# EAGLE design analog-interface (EAGLE 6.5.0)
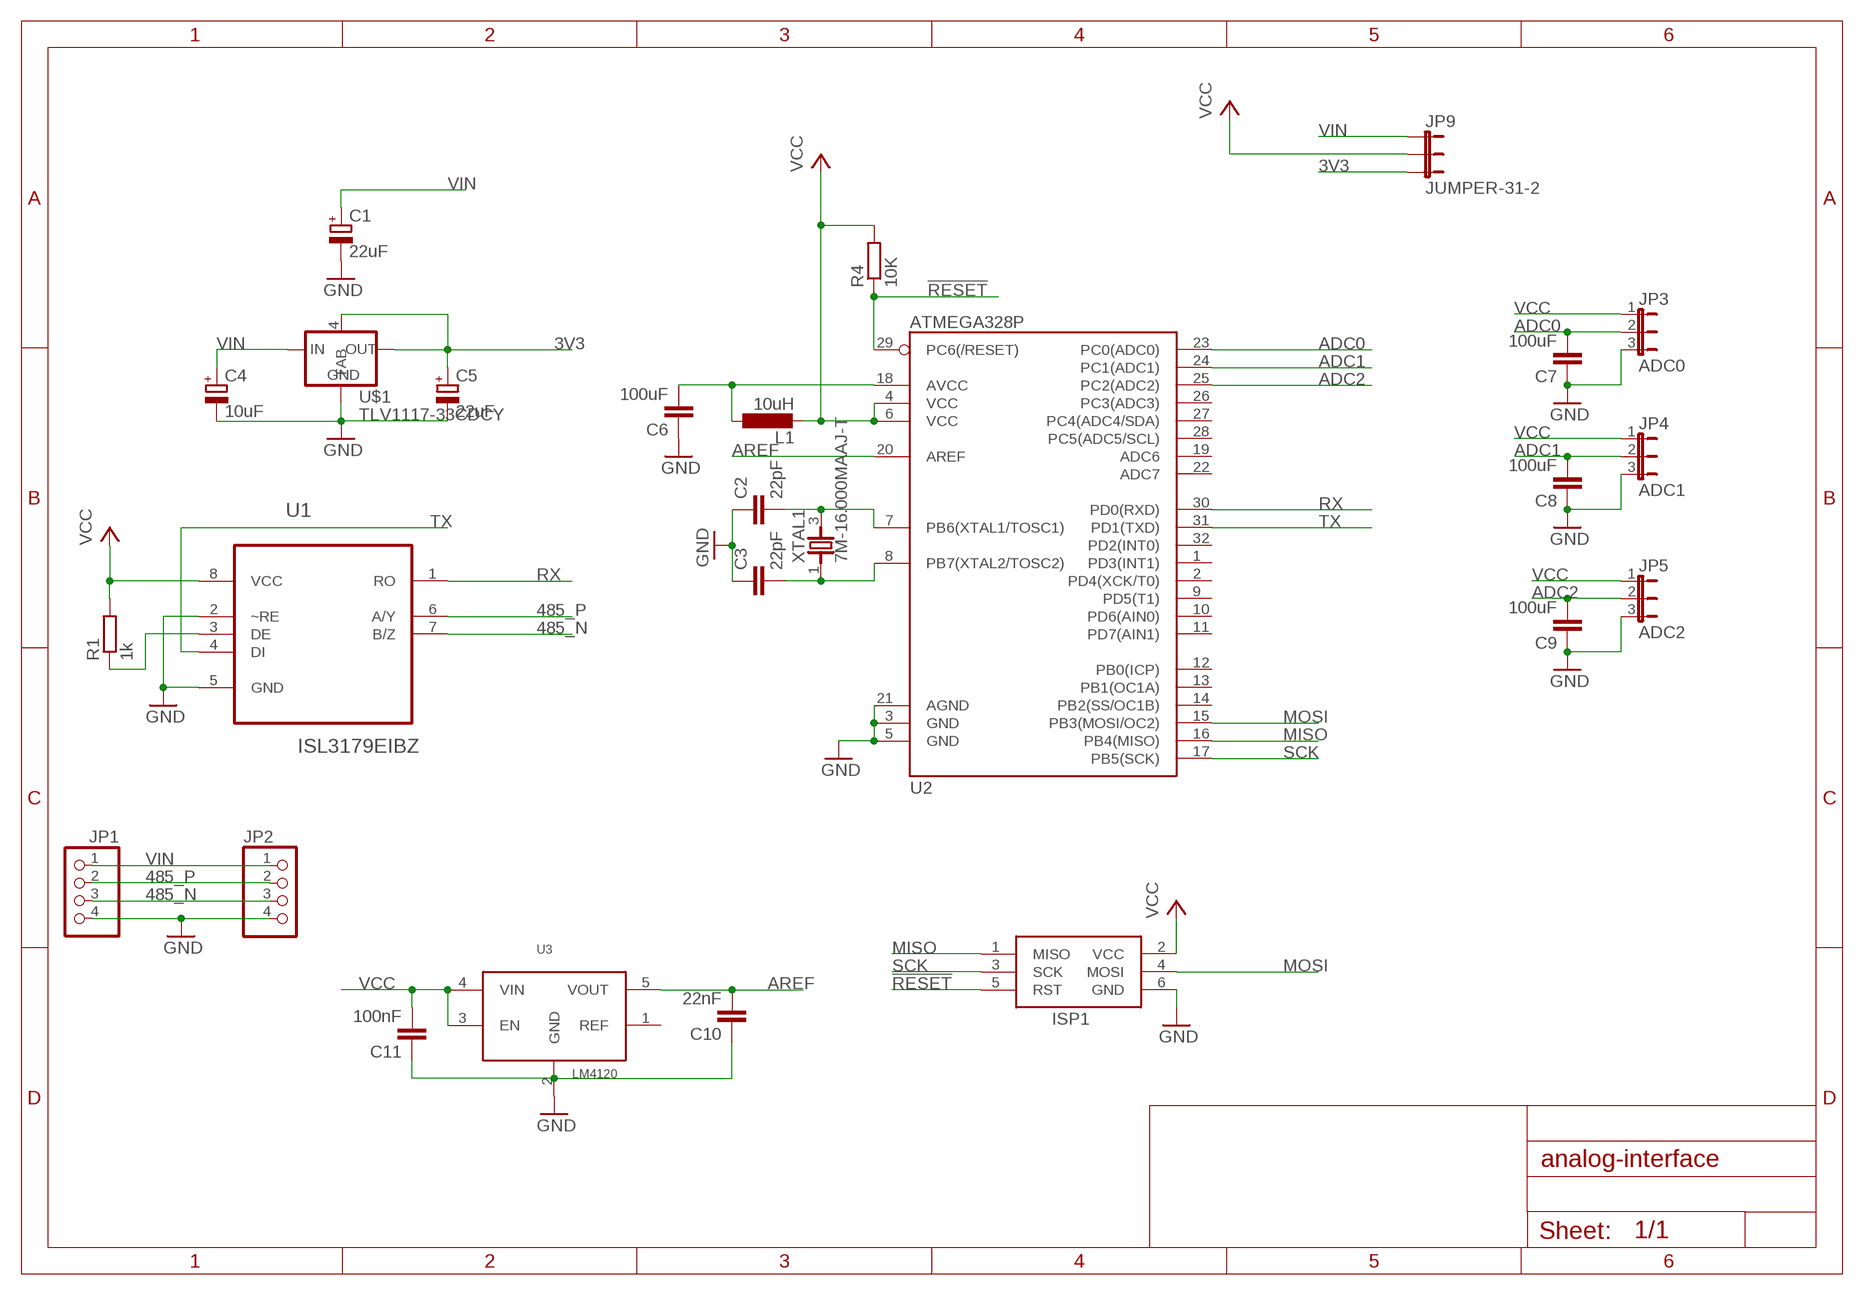
[diagram p0: schematic, sheet 1]

## Parts
C1  22uF  CPOL-EUA/3216-18R  [A/3216-18R]
C2  22pF  C-EUC0805  [C0805]
C3  22pF  C-EUC0805  [C0805]
C4  10uF  CPOL-EUA/3216-18R  [A/3216-18R]
C5  22uF  CPOL-EUA/3216-18R  [A/3216-18R]
C6  100uF  C-EUC0805  [C0805]
C7  100uF  C-EUC0805  [C0805]
C8  100uF  C-EUC0805  [C0805]
C9  100uF  C-EUC0805  [C0805]
C10  22nF  C-EUC0805  [C0805]
C11  100nF  C-EUC0805  [C0805]
ISP1  AVRISP-6  [AVRISP]
JP1  PINHD-1X4  [1X04]
JP2  PINHD-1X4  [1X04]
JP3  ADC0  3-PIN-MOLEX  [3-MOLEX]
JP4  ADC1  3-PIN-MOLEX  [3-MOLEX]
JP5  ADC2  3-PIN-MOLEX  [3-MOLEX]
JP9  JUMPER-31-2  [SJ_3_PASTE1&2]
L1  10uH  L-EUL3216C  [L3216C]
R1  1k  R-EU_R0805  [R0805]
R4  10K  R-EU_R0805  [R0805]
U1  ISL3179EIBZ  [SOIC127P600X175-8N]
U2  ATMEGA328P  ATMEGA328_SMT  [TQFP32-08]
U3  LM4120  [SOT23-5]
U$1  TLV1117-33CDCY  [SOT223]
XTAL1  7M-16.000MAAJ-T  [TXC_7M-16.000MAAJ-T]

## Nets
3V3: C5.+ JP9.3 U$1.2(OUT) U$1.4(TAB)
485_N [rs485]: JP1.3 JP2.3 U1.7(B/Z)
485_P [rs485]: JP1.2 JP2.2 U1.6(A/Y)
!RESET: ISP1.5(RST) R4.1 U2.29(PC6(/RESET))
ADC0: C7.2 JP3.2 U2.23(PC0(ADC0))
ADC1: C8.2 JP4.2 U2.24(PC1(ADC1))
ADC2: C9.2 JP5.2 U2.25(PC2(ADC2))
AREF: C10.2 U2.20(AREF) U3.5(VOUT)
GND: C1.- C2.1 C3.1 C4.- C5.- C6.1 C7.1 C8.1 C9.1 ISP1.6(GND) JP1.4 JP2.4 JP3.3 JP4.3 JP5.3 U1.2(~RE) U1.5(GND) U2.3(GND) U2.5(GND) U2.21(AGND) U3.2(GND) U$1.1(GND)
MISO: ISP1.1(MISO) U2.16(PB4(MISO))
MOSI: ISP1.4(MOSI) U2.15(PB3(MOSI/OC2))
N$1: R1.1 U1.3(DE)
N$2: C2.2 U2.7(PB6(XTAL1/TOSC1)) XTAL1.3
N$3: C3.2 U2.8(PB7(XTAL2/TOSC2)) XTAL1.1
N$4: C6.2 L1.1 U2.18(AVCC)
N$7: C10.1 C11.1
RX: U1.1(RO) U2.30(PD0(RXD))
SCK: ISP1.3(SCK) U2.17(PB5(SCK))
TX: U1.4(DI) U2.31(PD1(TXD))
VCC: C11.2 ISP1.2(VCC) JP3.1 JP4.1 JP5.1 JP9.2 L1.2 R1.2 R4.2 U1.8(VCC) U2.4(VCC) U2.6(VCC) U3.3(EN) U3.4(VIN)
VIN: C1.+ C4.+ JP1.1 JP2.1 JP9.1 U$1.3(IN)
Unconnected: U2.1(PD3(INT1)) U2.2(PD4(XCK/T0)) U2.9(PD5(T1)) U2.10(PD6(AIN0)) U2.11(PD7(AIN1)) U2.12(PB0(ICP)) U2.13(PB1(OC1A)) U2.14(PB2(SS/OC1B)) U2.19(ADC6) U2.22(ADC7) U2.26(PC3(ADC3)) U2.27(PC4(ADC4/SDA)) U2.28(PC5(ADC5/SCL)) U2.32(PD2(INT0)) U3.1(REF)

## Library data of the parts
C1 C4 C5 = resistor:CPOL-EU: POLARIZED CAPACITOR, European symbol
C2 C3 C6-C11 = resistor:C-EU: CAPACITOR, European symbol
ISP1 = adafruit:AVRISP: AVR ISP HEADER Standard 6 pin header for AVR programming
JP1 JP2 = pinhead:PINHD-1X4: PIN HEADER
JP3-JP5 = farnell-parts:3-PIN-MOLEX
JP9 = SparkFun-Passives:JUMPER-3
L1 = resistor:L-EU: INDUCTOR, European symbol
R1 R4 = resistor:R-EU_: RESISTOR, European symbol
U1 = glacsweb:ISL3179EIBZ: TRANCEIVER; MPN: ISL3179EIBZ; OC_FARNELL: 1439860; OC_NEWARK: 58M7513; PACKAGE: SOIC-8; SUPPLIER: Intersil
U2 = SparkFun-DigitalIC:ATMEGA328_SMT: 32-Pin Atmega328 part Commonly used on Arduino compatible boards Available in QFP and QFN packages TQFP is IC-09069 QFN is non-stock; PROD_ID: IC-09069
U3 = mountainsensing:LM4120
U$1 = basestation:TLV1117-33CDCY: Texas Instruments 3.3v 800mA Voltage Regulator http://uk.farnell.com/texas-instruments/tlv1117-33cdcy/v-reg-ldo-3-3v-0-8a-sot-223-4/dp/1494942 Datasheet: http://focus.ti.com/lit/ds/symlink/tlv1117-33.pdf
XTAL1 = TXC-7M-16.000MAAJ-T:7M-16.000MAAJ-T: CRYSTAL SEAM, 16MHZ, 18PF, SMD; MPN: 7M-16.000MAAJ-T; OC_FARNELL: 1842060; OC_NEWARK: 84R5710; PACKAGE: SMD; SUPPLIER: TXC

## Net classes
1 rs485: width 0.305 mm, clearance 0.254 mm

## Board
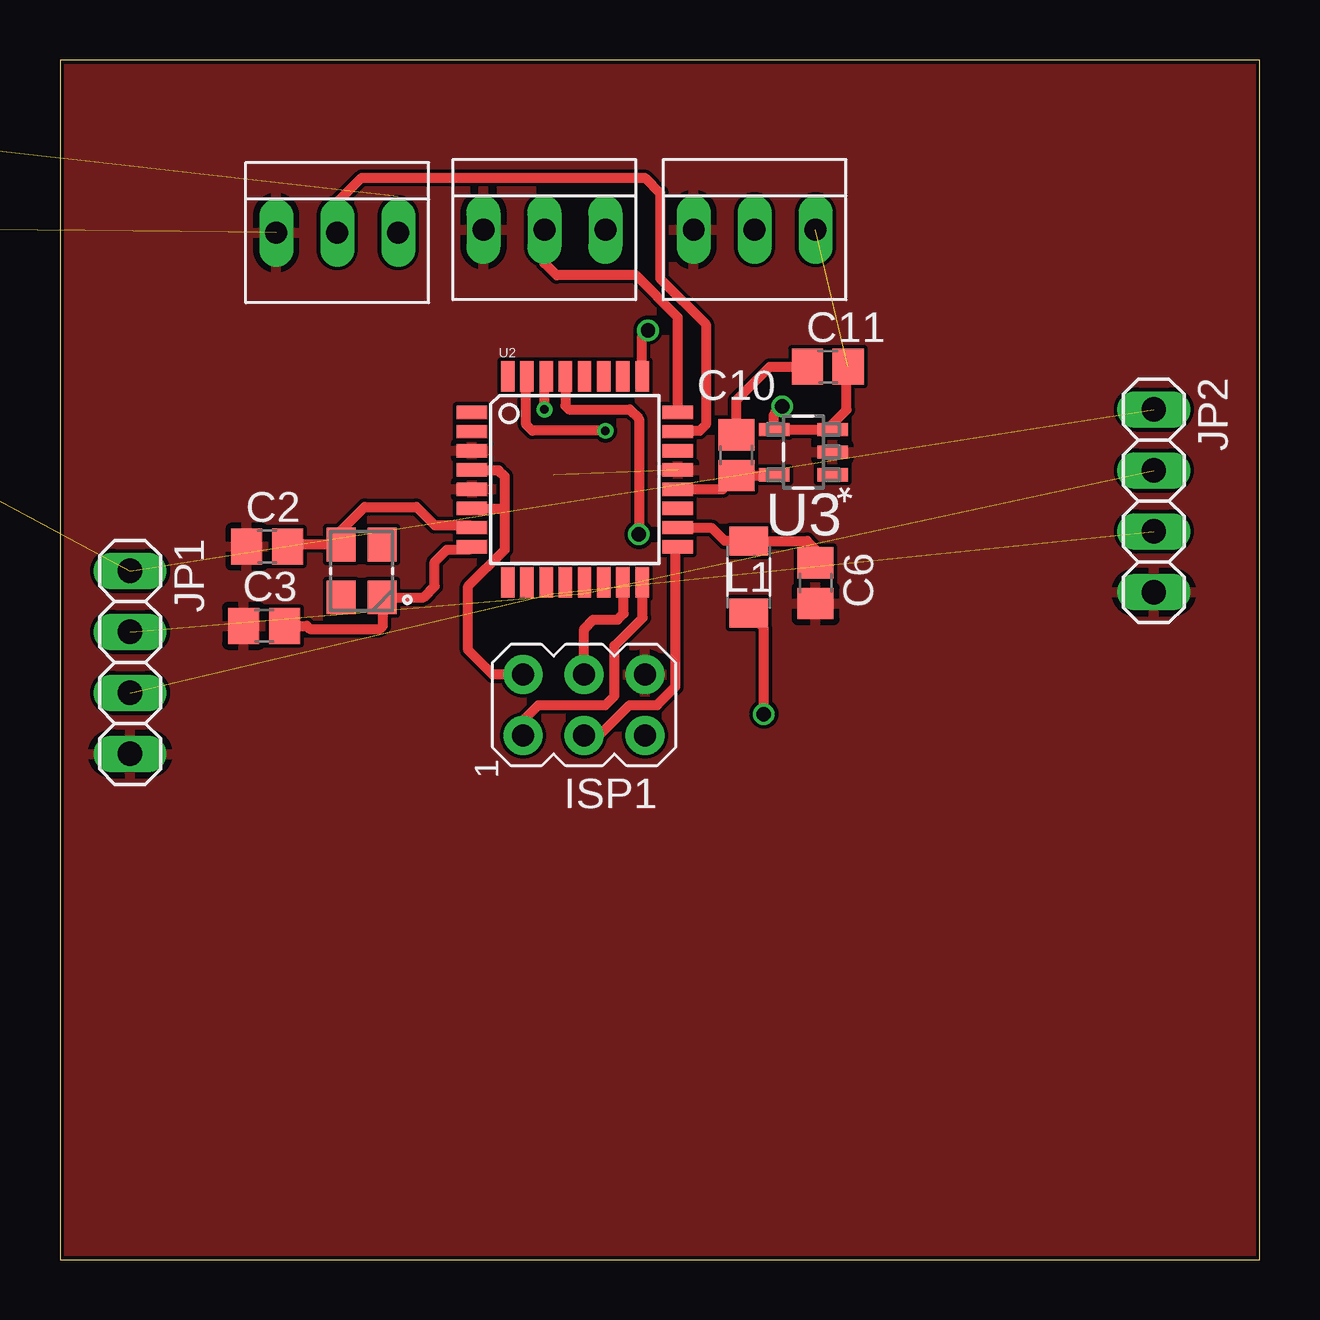
[diagram p1: board, top side]
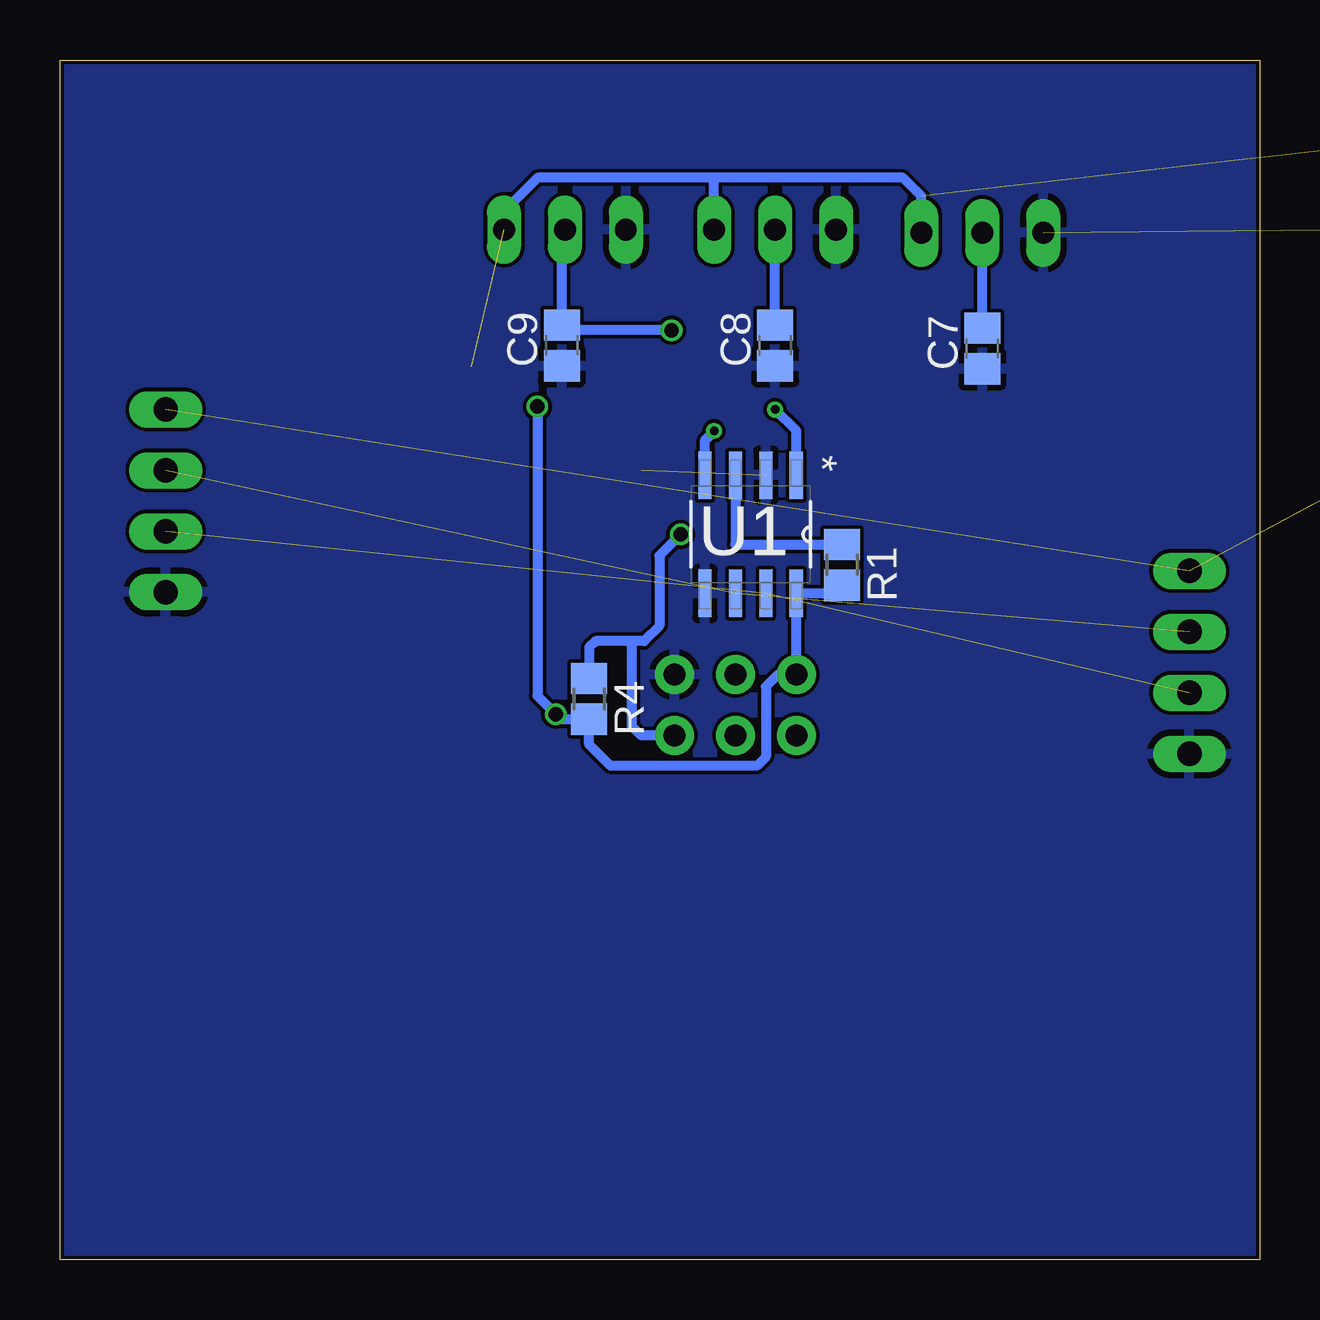
[diagram p2: board, bottom side, seen from below]

Size 50 x 50 mm. Coordinates in mm from the lower left corner, seen from the top.
Outline: 0,0 50,0 50,50 0,50 0,0
Copper layers (1*16): Top 0.035mm / dielectric 1.5mm / Bottom 0.035mm
Design rules "Hackvana": minimum track width 6mil, minimum drill 0.3mm, track to track 6mil, track to pad 6mil, pad to pad 6mil, via to via 6mil, smd to smd 0mil, copper to edge 6mil, drill to drill 6mil, minimum pad ring 10mil, minimum via ring 6mil, stop-mask expansion 2mil, vias tented up to drill 100mil, thermal gap 10mil

### Footprints (pad centres in the part's own frame; a part is rotated, then mirrored left to right if it is on the bottom)
A/3216-18R = smd 1.95 x 1.5: + 1.375,0; - -1.375,0
C0805 = smd 1.3 x 1.5: 1 -0.85,0; 2 0.85,0
AVRISP = drill 0.9 pad 1.626: 1 -1.27,2.54; 2 1.27,2.54; 3 -1.27,0; 4 1.27,0; 5 -1.27,-2.54; 6 1.27,-2.54
1X04 = drill 1.016 long: 1 -3.81,0; 2 -1.27,0; 3 1.27,0; 4 3.81,0
3-MOLEX = drill 0.914 long: 1 -2.54,0; 2 0,0; 3 2.54,0
SJ_3_PASTE1&2 = smd 0.635 x 1.27: 1 -0.813,0; 2 0,0; 3 0.813,0
L3216C = smd 1.2 x 1.6: 1 -1.5,0; 2 1.5,0
R0805 = smd 1.3 x 1.5: 1 -0.85,0; 2 0.85,0
SOIC127P600X175-8N = smd 1.981 x 0.559: 1 -2.464,1.905; 2 -2.464,0.635; 3 -2.464,-0.635; 4 -2.464,-1.905; 5 2.464,-1.905; 6 2.464,-0.635; 7 2.464,0.635; 8 2.464,1.905
TQFP32-08 = smd 1.27 x 0.559: 1 -4.293,2.8; 2 -4.293,2; 3 -4.293,1.2; 4 -4.293,0.4; 5 -4.293,-0.4; 6 -4.293,-1.2; 7 -4.293,-2; 8 -4.293,-2.8; 17 4.293,-2.8; 18 4.293,-2; 19 4.293,-1.2; 20 4.293,-0.4; 21 4.293,0.4; 22 4.293,1.2; 23 4.293,2; 24 4.293,2.8 | smd 0.559 x 1.27: 9 -2.8,-4.293; 10 -2,-4.293; 11 -1.2,-4.293; 12 -0.4,-4.293; 13 0.4,-4.293; 14 1.2,-4.293; 15 2,-4.293; 16 2.8,-4.293; 25 2.8,4.293; 26 2,4.293; 27 1.2,4.293; 28 0.4,4.293; 29 -0.4,4.293; 30 -1.2,4.293; 31 -2,4.293; 32 -2.8,4.293
SOT23-5 = smd 1.27 x 0.559: 1 -1.219,0.94; 2 -1.219,0; 3 -1.219,-0.94; 4 1.219,-0.94; 5 1.219,0.94
SOT223 = smd 1.5 x 2: 1 -2.3,-3.15; 2 0,-3.15; 3 2.3,-3.15 | smd 3.8 x 2: 4 0,3.15
TXC_7M-16.000MAAJ-T = smd 1.4 x 1.2: 1 -1.1,-0.85; 2 1.1,-0.85; 3 1.1,0.85; 4 -1.1,0.85

### Placement (x,y rotation side)
C1  -25.4,43.18 0 top  (outside the outline)
C2  8.64,29.72 0 top
C3  8.51,26.42 0 top
C4  -35.56,30.48 270 top  (outside the outline)
C5  -49.53,30.48 90 top  (outside the outline)
C6  31.5,28.19 90 top
C7  11.56,37.97 90 bottom
C8  20.19,38.1 90 bottom
C9  29.08,38.1 90 bottom
C10  28.19,33.53 270 top
C11  32,37.21 0 top
ISP1  21.84,23.11 90 top
JP1  2.92,24.89 270 top
JP2  45.59,31.62 270 top
JP3  11.56,42.8 180 top
JP4  20.19,42.93 180 top
JP5  28.96,42.93 180 top
JP9  -31.75,49.53 0 top  (outside the outline)
L1  28.7,28.45 270 top
R1  17.4,28.96 270 bottom
R4  27.94,23.37 270 bottom
U1  21.21,30.23 270 bottom
U2  21.46,32.51 0 top
U3  30.99,33.66 180 top
U$1  -43.18,30.48 0 top  (outside the outline)
XTAL1  12.57,28.7 90 top

### Tracks (layer width: path | path; a pad name or v marks a point on that pad's centre or on a via)
3V3  (3 unrouted)
485_N  (2 unrouted)
485_P  (2 unrouted)
!RESET  (via drill 0.6)
  Top 0.406: U2.29 21.06,35.58 21.21,35.43 23.75,35.43 24.13,35.05 v24.13,30.23
  Bottom 0.406: v24.13,30.23 25.02,29.34 25.02,26.42 25.65,25.78 26.16,25.78 | 26.16,25.78 27.69,25.78 27.94,25.53 R4.1 | ISP1.5 25.78,21.84 26.16,22.23 26.16,25.78
ADC0
  Top 0.406: JP3.2 11.56,44.07 12.57,45.09 24.38,45.09 25.02,44.45 25.02,40.89 26.92,38.99 26.92,34.8 26.67,34.54 25.79,34.54 U2.23
  Bottom 0.406: C7.2 JP3.2
ADC1
  Top 0.406: U2.24 25.76,39.27 24,41.02 20.7,41.02 20.19,41.53 JP4.2
  Bottom 0.406: C8.2 JP4.2
ADC2  (via drill 0.6)
  Top 0.406: U2.25 24.26,38.49 v24.51,38.73
  Bottom 0.406: JP5.2 29.08,42.8 C9.2 28.87,38.73 v24.51,38.73
AREF
  Top 0.406: U2.20 27.63,32.11 C10.2 29.73,32.68 U3.5
GND  (5 unrouted)
  pour Bottom: -5.97,56.13 58.8,56.13 58.8,-6.73 -5.97,-6.73
  pour Top: -3.68,52.2 55.88,52.2 55.5,-3.94 -4.06,-3.94
MISO
  Top 0.406: ISP1.1 19.3,22.48 19.94,23.11 22.73,23.11 23.11,23.5 23.11,25.58 24.28,26.75 24.28,28.2 U2.16
MOSI
  Top 0.406: ISP1.4 21.84,26.29 22.23,26.67 23.24,26.67 23.5,26.92 23.5,28.19 U2.15
N$1
  Bottom 0.406: U1.3 21.84,29.81 R1.1
N$2
  Top 0.406: U2.7 17.07,30.61 15.62,30.61 14.86,31.37 12.7,31.37 11.72,30.39 XTAL1.3 9.57,29.8 C2.2
N$3
  Top 0.406: U2.8 17.05,29.59 16.13,29.59 15.62,29.08 15.62,28.07 15.16,27.6 XTAL1.1 13.46,27.56 13.46,26.42 13.34,26.29 10.41,26.29 10.29,26.42 C3.2
N$4
  Top 0.406: U2.18 25.79,30.48 27.18,30.48 27.71,29.95 L1.1 31.14,29.95 31.5,29.59 C6.2
N$7
  Top 0.406: C10.1 28.19,35.81 29.59,37.21 C11.1
RX  (via drill 0.36)
  Top 0.406: v20.19,35.43 20.19,36.73 U2.30
  Bottom 0.406: U1.1 19.3,34.54 v20.19,35.43
SCK
  Top 0.406: ISP1.3 22.48,21.84 23.75,23.11 24.89,23.11 25.65,23.88 25.65,29.61 U2.17
TX  (via drill 0.36)
  Top 0.406: v22.73,34.54 19.68,34.54 19.43,34.8 19.43,36.77 U2.31
  Bottom 0.406: U1.4 23.11,34.16 v22.73,34.54
VCC  (via drill 0.6)  (2 unrouted)
  Top 0.406: ISP1.2 18.03,24.38 17.02,25.4 17.02,28.07 18.54,29.59 18.54,31.37 | 18.54,31.37 18.54,32.64 18.29,32.89 17.19,32.89 U2.4 | U2.6 18.48,31.31 18.54,31.37 | v29.34,22.73 29.34,26.31 L1.2 | C11.2 32.79,37.15 32.79,35.41 32.21,34.82 U3.3 U3.4 29.77,35.23 v30.1,35.56
  Bottom 0.406: R1.2 17.4,27.76 U1.8 | JP3.1 14.1,44.32 14.86,45.09 22.86,45.09 | 22.86,45.09 30.1,45.09 31.5,43.69 JP5.1 | JP4.1 22.73,44.96 22.86,45.09 | U1.8 ISP1.2 20.07,24.38 20.57,23.88 20.57,20.95 20.95,20.57 27.05,20.57 27.94,21.46 R4.2 29.12,22.52 v29.34,22.73 30.1,23.5 v30.1,35.56 | 19.3,28.52 U1.8
VIN  (5 unrouted)